# Altium schematic sheet PiCarHat_Master_V4.SchDoc
size A2; SheetNumber: 1; SheetTotal: 1; SPICEModelCacheWKMVAURK: <root> / <DocumentId>WKMVAURK</DocumentId> / </root>
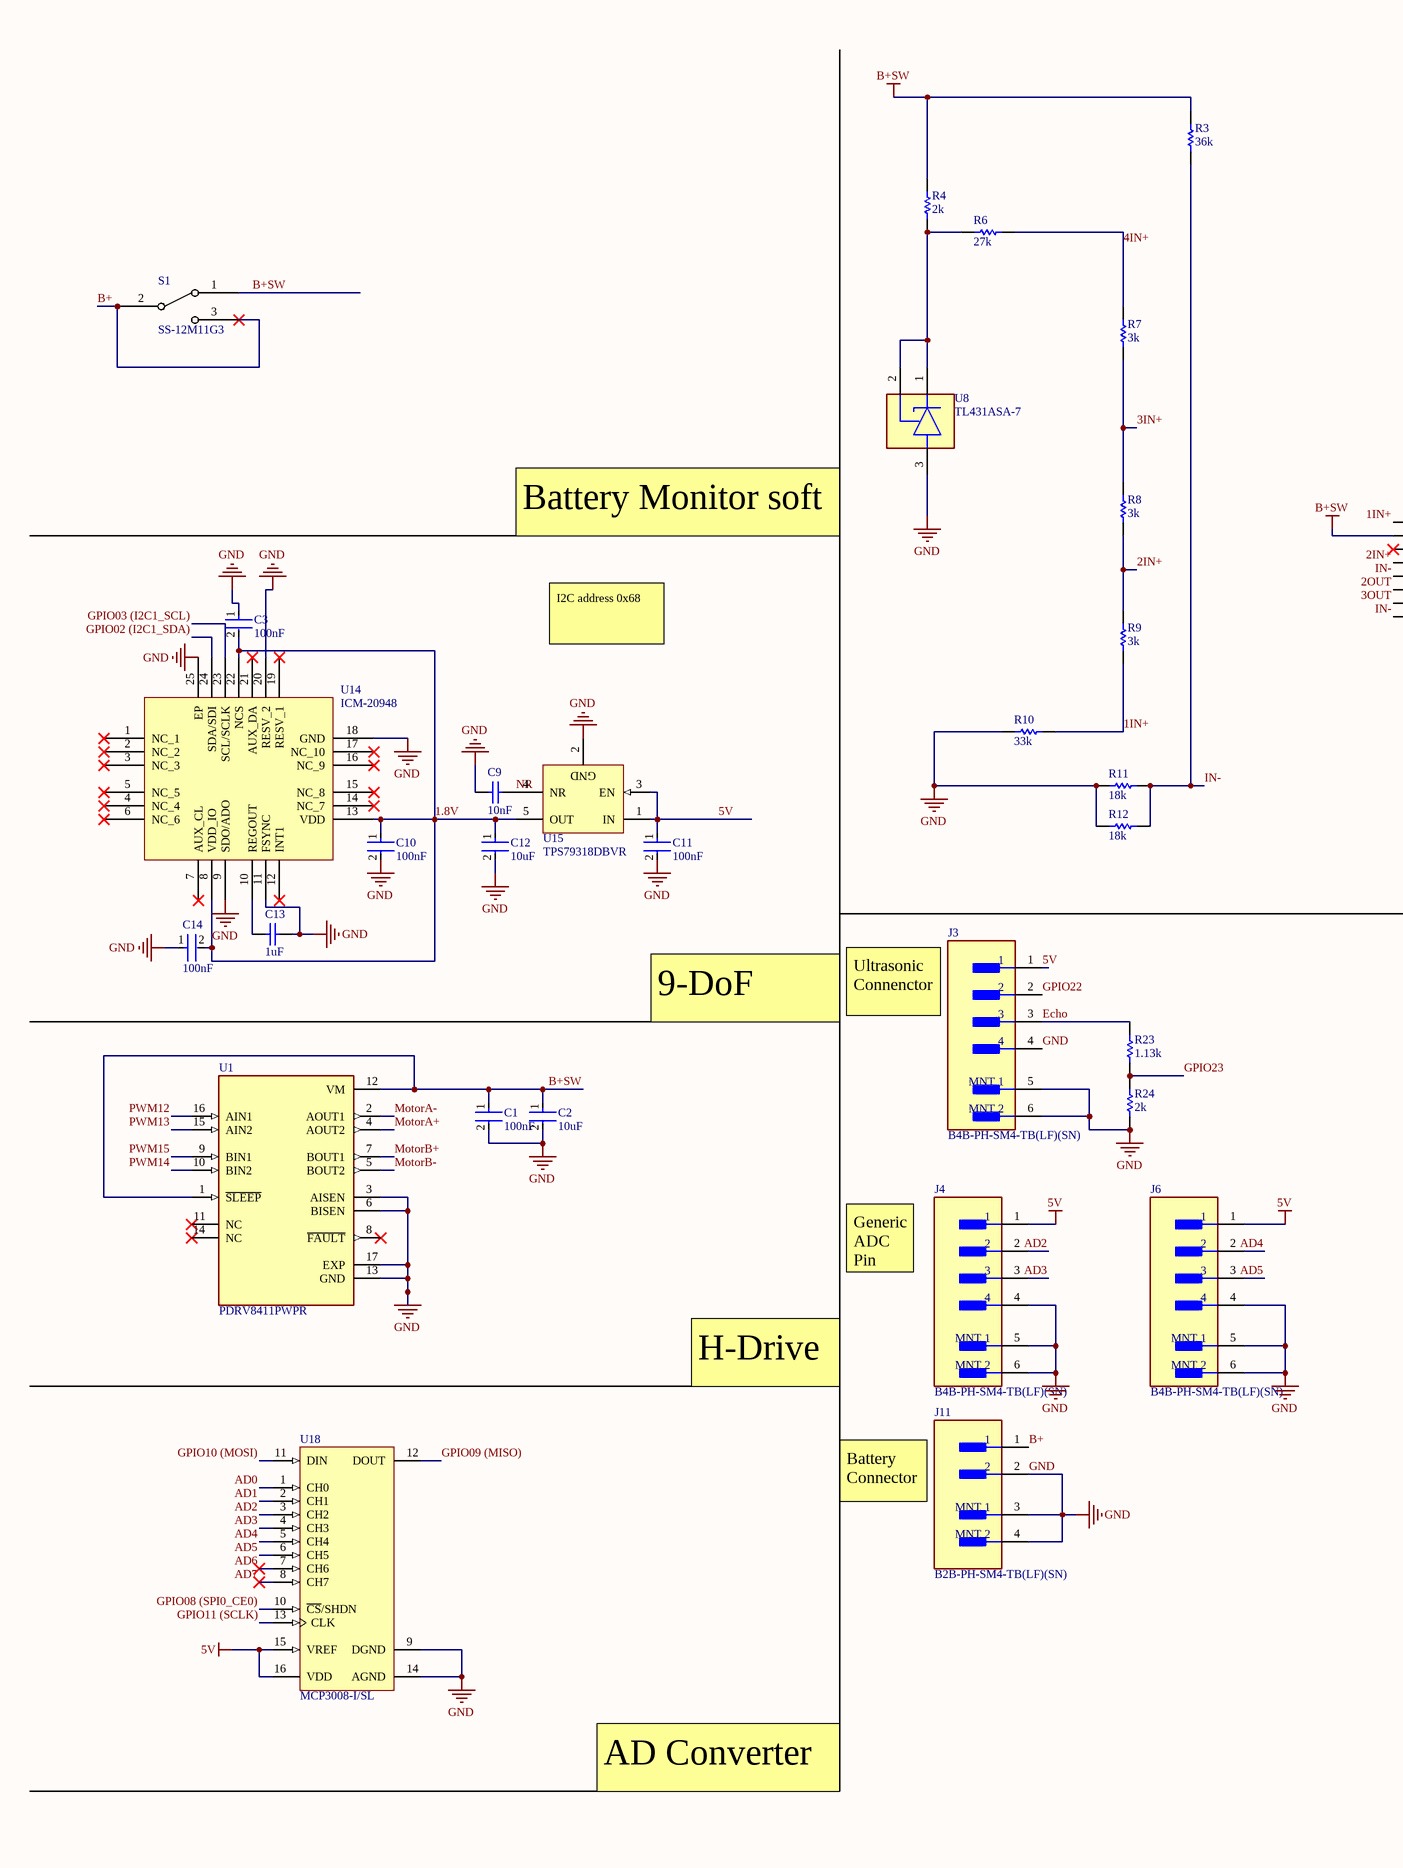
[diagram p0: PiCarHat_Master_V4.SchDoc, left]
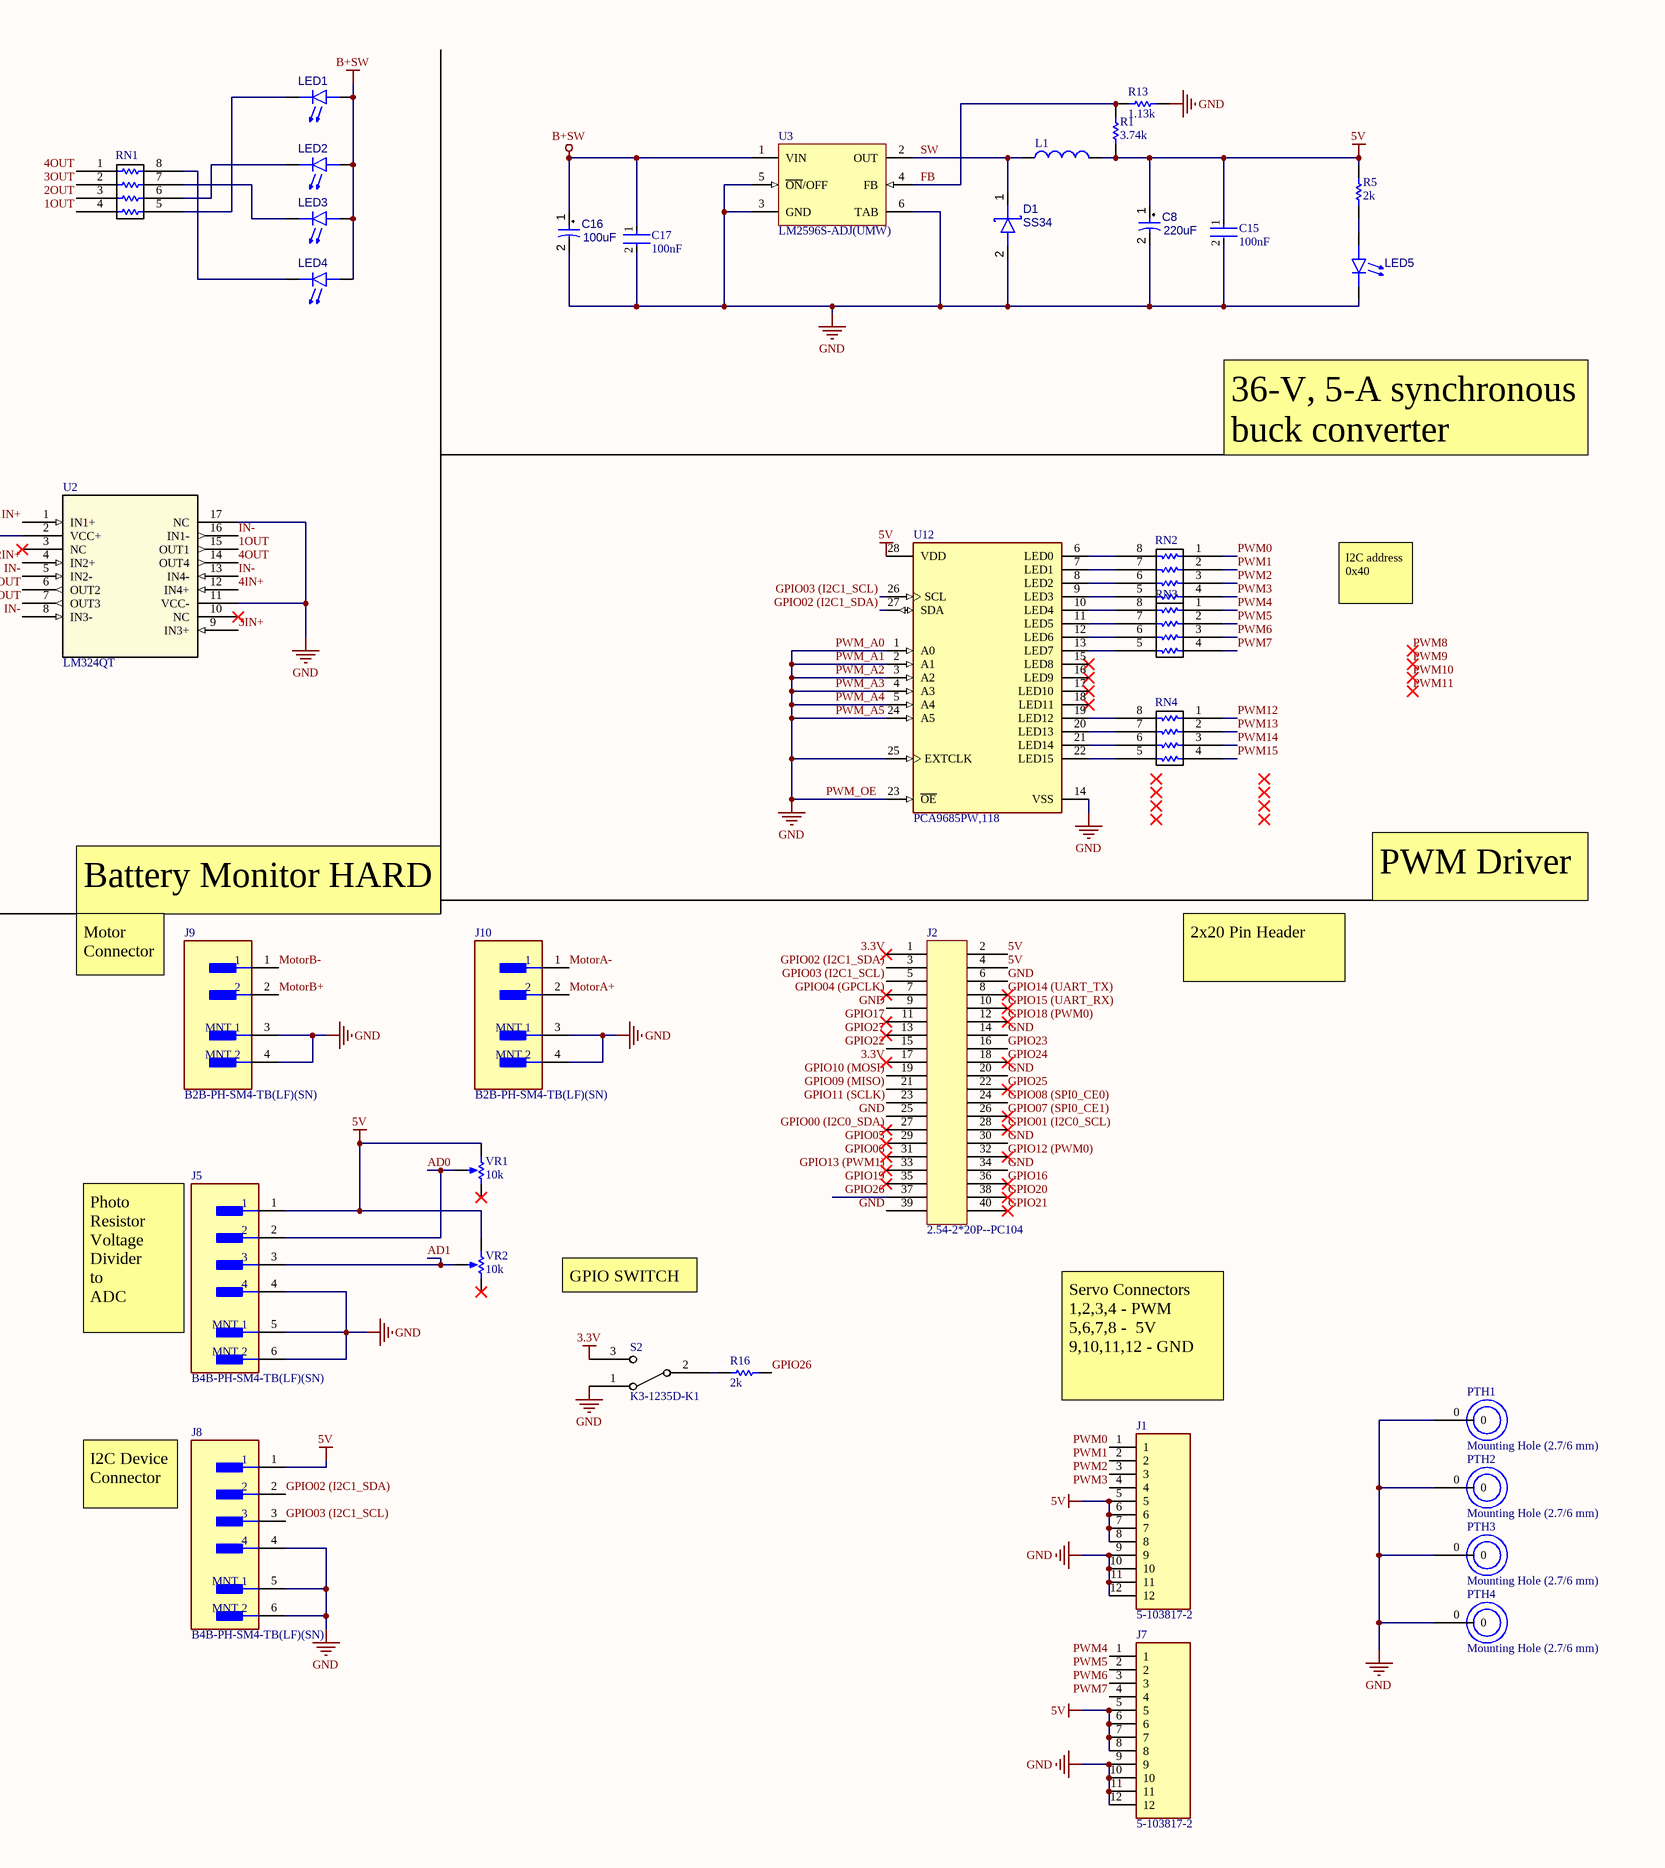
[diagram p1: PiCarHat_Master_V4.SchDoc, right]

## Parts
C1  100nF  [FP-CC0805-0_85-IPC_B]
C2  10uF  [FP-GRM21B-0_15-MFG]
C3  100nF  [FP-CC0805-0_85-IPC_B]
C8  220uF  [RVT1A221M0605-Footprint-1]
C9  10nF  [CAPC2013X100X50NL20T25]
C10  100nF  [FP-CC0805-0_85-IPC_B]
C11  100nF  [FP-CC0805-0_85-IPC_B]
C12  10uF  [FP-GRM21B-0_15-MFG]
C13  1uF  [CAPC2013X140X50LL20T25]
C14  100nF  [FP-CC0805-0_85-IPC_B]
C15  100nF  [FP-CC0805-0_85-IPC_B]
C16  100uF  [RVT1C101M0605-Footprint-1]
C17  100nF  [FP-CC0805-0_85-IPC_B]
D1  SS34  [SS34-Footprint-1]
J1  5-103817-2  [TE_5-103817-2]
J2  2.54-2*20P--PC104  [New footprint 1]
J3  B4B-PH-SM4-TB(LF)(SN)  [FP-B4B-PH-SM4-TB-MFG]
J4  B4B-PH-SM4-TB(LF)(SN)  [FP-B4B-PH-SM4-TB-MFG]
J5  B4B-PH-SM4-TB(LF)(SN)  [FP-B4B-PH-SM4-TB-MFG]
J6  B4B-PH-SM4-TB(LF)(SN)  [FP-B4B-PH-SM4-TB-MFG]
J7  5-103817-2  [TE_5-103817-2]
J8  B4B-PH-SM4-TB(LF)(SN)  [FP-B4B-PH-SM4-TB-MFG]
J9  B2B-PH-SM4-TB(LF)(SN)  [FP-B2B-PH-SM4-TB_LF_SN-MFG]
J10  B2B-PH-SM4-TB(LF)(SN)  [FP-B2B-PH-SM4-TB_LF_SN-MFG]
J11  B2B-PH-SM4-TB(LF)(SN)  [FP-B2B-PH-SM4-TB_LF_SN-MFG]
L1  FXL1050-470-M  [FXL1050-470-M-Footprint-1]  (value not drawn)
LED1  KT-0603R  [XL-1608SURC-06-Footprint-1]  (value not drawn)
LED2  KT-0603R  [XL-1608SURC-06-Footprint-1]  (value not drawn)
LED3  KT-0603R  [XL-1608SURC-06-Footprint-1]  (value not drawn)
LED4  KT-0603R  [XL-1608SURC-06-Footprint-1]  (value not drawn)
LED5  KT-0603R  [XL-1608SURC-06-Footprint-1]  (value not drawn)
PTH1  Mounting Hole (2.7/6 mm)  [New footprint 1]
PTH2  Mounting Hole (2.7/6 mm)  [New footprint 1]
PTH3  Mounting Hole (2.7/6 mm)  [New footprint 1]
PTH4  Mounting Hole (2.7/6 mm)  [New footprint 1]
R1  3.74k  [RESC1608X55X30LL15T15]
R3  36k  [RESC1608X55X30LL20T20]
R4  2k  [RESC1608X55X25LL10T15]
R5  2k  [RESC1608X55X25LL10T15]
R6  27k  [RESC1608X55X25LL10T15]
R7  3k  [RESC1608X55X25LL10T15]
R8  3k  [RESC1608X55X25LL10T15]
R9  3k  [RESC1608X55X25LL10T15]
R10  33k  [RESC1608X55X25LL10T15]
R11  18k  [RESC1608X55X30LL15T15]
R12  18k  [RESC1608X55X30LL15T15]
R13  1.13k  [RESC1609X50X30LL10T20]
R16  2k  [RESC1608X55X25LL10T15]
R23  1.13k  [RESC1609X50X30LL10T20]
R24  2k  [RESC1608X55X25LL10T15]
RN1  4D03WGJ0103T5E  [4D03WGJ0103T5E-Footprint-1]  (value not drawn)
RN2  4D03WGJ0101T5E  [4D03WGJ0101T5E-Footprint-1]  (value not drawn)
RN3  4D03WGJ0101T5E  [4D03WGJ0101T5E-Footprint-1]  (value not drawn)
RN4  4D03WGJ0101T5E  [4D03WGJ0101T5E-Footprint-1]  (value not drawn)
S1  SS-12M11G3  [SS-12M11G5-Footprint-1]
S2  K3-1235D-K1  [K3-1235D-K1-Footprint-1]
U1  PDRV8411PWPR  [PWP0016C-IPC_B]
U2  LM324QT  [LM324QT-Footprint-1]
U3  LM2596S-ADJ(UMW)  [TS5B_L]
U8  TL431ASA-7  [FP-SOT23-MFG]
U12  PCA9685PW,118  [FP-SOT361-1-IPC_B]
U14  ICM-20948  [TDK-QFN-24_L]
U15  TPS79318DBVR  [DBV0005A_M]
U18  MCP3008-I/SL  [SOIC-SL16_L]
VR1  value 10k  [BOUR-3362P]  (hidden comment: 3362P-1-103LF)
VR2  value 10k  [BOUR-3362P]  (hidden comment: 3362P-1-103LF)

## Nets
3.3V: J2.1 J2.17 S2.3
5V: C8.1 C11.1 C15.1 J1.5 J1.6 J1.7 J1.8 J2.2 J2.4 J3.1 J4.1 J5.1 J6.1 J7.5 J7.6 J7.7 J7.8 J8.1 L1.2 R1.1 R5.2 U12.28(VDD) U15.1(IN) U15.3(EN) U18.15(VREF) U18.16(VDD) VR1.1(CCW) VR2.1(CCW)
B+SW: C1.1 C2.1 C16.1 C17.1 LED1.2(A) LED2.2(A) LED3.2(A) LED4.2(A) R3.2 R4.2 S1.1 U1.1(~{SLEEP}) U1.12(VM) U2.2(VCC+) U3.1(VIN)
GND: C1.2 C2.2 C3.1 C8.2 C9.1 C10.2 C11.2 C12.2 C13.2 C14.1 C15.2 C16.2 C17.2 D1.2(A) J1.9 J1.10 J1.11 J1.12 J2.6 J2.9 J2.14 J2.20 J2.25 J2.30 J2.34 J2.39 J3.4 J3.5(MNT_1) J3.6(MNT_2) J4.4 J4.5(MNT_1) J4.6(MNT_2) J5.4 J5.5(MNT_1) J5.6(MNT_2) J6.4 J6.5(MNT_1) J6.6(MNT_2) J7.9 J7.10 J7.11 J7.12 J8.4 J8.5(MNT_1) J8.6(MNT_2) J9.3(MNT_1) J9.4(MNT_2) J10.3(MNT_1) J10.4(MNT_2) J11.2 J11.3(MNT_1) J11.4(MNT_2) LED5.1(K) PTH1.0 PTH2.0 PTH3.0 PTH4.0 R10.1 R11.1 R12.1 R13.2 R24.1 S2.1 U1.3(AISEN) U1.6(BISEN) U1.13(GND) U1.17(EXP) U2.11(VCC-) U2.17(NC) U3.3(GND) U3.5(~{ON}/OFF) U3.6(TAB) U8.3(A) U12.1(A0) U12.2(A1) U12.3(A2) U12.4(A3) U12.5(A4) U12.14(VSS) U12.23(~{OE}) U12.24(A5) U12.25(EXTCLK) U14.9(SDO/ADO) U14.11(FSYNC) U14.18(GND) U14.20(RESV_2) U14.25(EP) U15.2(GND) U18.9(DGND) U18.14(AGND)  [also labelled PWM_A0, PWM_A1, PWM_A2, PWM_A3, PWM_A4, PWM_A5, PWM_OE]
1.8V: C3.2 C10.1 C12.1 C14.2 U14.8(VDD_IO) U14.13(VDD) U14.22(NCS) U15.5(OUT)
1IN+: R9.2 R10.2 U2.1(IN1+)
1OUT: RN1.4 U2.15(OUT1)
2IN+: R8.2 R9.1 U2.4(IN2+)
2OUT: RN1.3 U2.6(OUT2)
3IN+: R7.2 R8.1 U2.9(IN3+)
3OUT: RN1.2 U2.7(OUT3)
4IN+: R6.2 R7.1 U2.12(IN4+)
4OUT: RN1.1 U2.14(OUT4)
AD0: J5.2 U18.1(CH0) VR1.2(S)
AD1: J5.3 U18.2(CH1) VR2.2(S)
AD2: J4.2 U18.3(CH2)
AD3: J4.3 U18.4(CH3)
AD4: J6.2 U18.5(CH4)
AD5: J6.3 U18.6(CH5)
AD6: U18.7(CH6)
AD7: U18.8(CH7)
B+: J11.1 S1.2 S1.3
Echo: J3.3 R23.2
FB: R1.2 R13.1 U3.4(FB)
GPIO00 (I2C0_SDA): J2.27
GPIO01 (I2C0_SCL): J2.28
GPIO02 (I2C1_SDA): J2.3 J8.2 U12.27(SDA) U14.24(SDA/SDI)
GPIO03 (I2C1_SCL): J2.5 J8.3 U12.26(SCL) U14.23(SCL/SCLK)
GPIO04 (GPCLK): J2.7
GPIO05: J2.29
GPIO06: J2.31
GPIO07 (SPI0_CE1): J2.26
GPIO08 (SPI0_CE0): J2.24 U18.10(~{CS}/SHDN)
GPIO09 (MISO): J2.21 U18.12(DOUT)
GPIO10 (MOSI): J2.19 U18.11(DIN)
GPIO11 (SCLK): J2.23 U18.13(CLK)
GPIO12 (PWM0): J2.32
GPIO13 (PWM1): J2.33
GPIO14 (UART_TX): J2.8
GPIO15 (UART_RX): J2.10
GPIO16: J2.36
GPIO17: J2.11
GPIO18 (PWM0): J2.12
GPIO19: J2.35
GPIO20: J2.38
GPIO21: J2.40
GPIO22: J2.15 J3.2
GPIO23: J2.16 R23.1 R24.2
GPIO24: J2.18
GPIO25: J2.22
GPIO26: J2.37 R16.1
GPIO27: J2.13
IN-: R3.1 R11.2 R12.2 U2.5(IN2-) U2.8(IN3-) U2.13(IN4-) U2.16(IN1-)
MotorA+: J10.2 U1.4(AOUT2)
MotorA-: J10.1 U1.2(AOUT1)
MotorB+: J9.2 U1.7(BOUT1)
MotorB-: J9.1 U1.5(BOUT2)
NR: C9.2 U15.4(NR)
PWM0: J1.1 RN2.1
PWM1: J1.2 RN2.2
PWM2: J1.3 RN2.3
PWM3: J1.4 RN2.4
PWM4: J7.1 RN3.1
PWM5: J7.2 RN3.2
PWM6: J7.3 RN3.3
PWM7: J7.4 RN3.4
PWM12: RN4.1 U1.16(AIN1)
PWM13: RN4.2 U1.15(AIN2)
PWM14: RN4.3 U1.10(BIN2)
PWM15: RN4.4 U1.9(BIN1)
SW: D1.1(K) L1.1 U3.2(OUT)
NetC13_1: C13.1 U14.10(REGOUT)
NetLED1_1: LED1.1(K) RN1.5
NetLED2_1: LED2.1(K) RN1.6
NetLED3_1: LED3.1(K) RN1.7
NetLED4_1: LED4.1(K) RN1.8
NetLED5_2: LED5.2(A) R5.1
NetR4_1: R4.1 R6.1 U8.1(C) U8.2(REF)
NetR16_2: R16.2 S2.2
NetRN2_5: RN2.5 U12.9(LED3)
NetRN2_6: RN2.6 U12.8(LED2)
NetRN2_7: RN2.7 U12.7(LED1)
NetRN2_8: RN2.8 U12.6(LED0)
NetRN3_5: RN3.5 U12.13(LED7)
NetRN3_6: RN3.6 U12.12(LED6)
NetRN3_7: RN3.7 U12.11(LED5)
NetRN3_8: RN3.8 U12.10(LED4)
NetRN4_5: RN4.5 U12.22(LED15)
NetRN4_6: RN4.6 U12.21(LED14)
NetRN4_7: RN4.7 U12.20(LED13)
NetRN4_8: RN4.8 U12.19(LED12)

Not connected (* = marked no-connect by the designer): U1 8(~{FAULT})* 11(NC)* 14(NC)*; U2 3(NC)* 10(NC)*; U12 15(LED8)* 16(LED9)* 17(LED10)* 18(LED11)*; U14 1(NC_1)* 2(NC_2)* 3(NC_3)* 4(NC_4)* 5(NC_5)* 6(NC_6)* 7(AUX_CL)* 12(INT1)* 14(NC_7)* 15(NC_8)* 16(NC_9)* 17(NC_10)* 19(RESV_1)* 21(AUX_DA)*; VR1 3(CW)*; VR2 3(CW)*

## Notes on the sheet
- 36-V, 5-A synchronous buck converter 12-WSON -40 to 150
- Battery Monitor soft
- I2C address 0x40
- I2C address 0x68
- Battery Monitor HARD
- PWM Driver
- Motor
  Connector
- 2x20 Pin Header
- 9-DoF IMU
- Ultrasonic
  Connenctor
- Generic
  ADC
  Pin
- Photo
  Resistor
  Voltage
  Divider
  to
  ADC
- GPIO SWITCH
- H-Drive
- (near J1) Servo Connectors
  1,2,3,4 - PWM
  5,6,7,8 -  5V
  9,10,11,12 - GND
- Battery
  Connector
- I2C Device
  Connector
- AD Converter
- Labels drawn without touching a wire or pin: PWM8, PWM9, PWM10, PWM11

## Library data of the parts
C1 C3 C10 C11 C14 C15 C17 = CMP-2100-03606-3: 50V 100nF X7R ±10% 0805 Multilayer Ceramic Capacitors MLCC - SMD/SMT ROHS; Part Number: CC0805KRX7R9BB104; Manufacturer: Yageo; Tolerance: 0.1; Device Class L1: Passive Components; ComponentLink2Description: Datasheet; Package: CC0805-0.85; Digikey Description: CAP CER 0.1UF 50V X7R 0805; Capacitance: 100 nF; Device Class L3: Ceramic Capacitors; Value: 100 nF; Temperature: -30°C to +85°C; Temperature Characteristic: X7R; Voltage Rating: 50 V; Height: 0.95mm; RoHS: TRUE; Ipc Land Pattern Name: CAPC200125X85; Device Class L2: Capacitors; Category: Cap; Temperature Range Low: -30°C; Temperature Range High: +85°C; Material: Ceramic; Mouser Description: Multilayer Ceramic Capacitors MLCC - SMD/SMT 100nF 50V X7R 10%; Footprint Url: http://www.yageo.com/exep/pages/download/literatures/UPY-C_GEN_24.pdf; Automotive: No; Octopart: https://octopart.com/cc0805krx7r9bb104-yageo-192993; Lead Free: Yes; ComponentLink2URL: http://www.yageo.com/documents/recent/UPY-GPHC_Y5V_6.3V-to-50V_8.pdf; JLCPCB Part #: C1711
C2 C12 = CMP-2007-03541-2: 25V 10uF X5R ±10% 0805 Multilayer Ceramic Capacitors MLCC - SMD/SMT ROHS; Part Number: GRM21BR61E106KA73L; Length: 2mm; Depth: 1.25mm; Termination: SMD/SMT; Voltage: 25V; Height: 1.25mm; Material: Ceramic; Thickness: 0.053inch; Radiation Hardening: No; Min Operating Temperature: -55°C; Width: 0.049inch; Package Quantity: 1; Mount: Surface Mount; Dielectric: X5R; Packaging: Tape and Reel; Capacitance: 10uF; Voltage Rating (DC): 25V; Lead Free: Lead Free; Max Operating Temperature: 85°C; Case Code (Imperial): 0805; Case/Package: 0805; Tolerance: 10%; Voltage Rating: 25V; Case Code (Metric): 2012; JLCPCB Part #: C15850
C8 = CMP-001-00090-1: 220uF 10V 90mA@120Hz ±20% SMD, D6.3xL5.4mm Aluminum Electrolytic Capacitors - SMD ROHS; Part Number: RVT1A221M0605; JLCPCB Part #: C3345
C9 = CMP-2007-03708-1: 50V 10nF X7R ±10% 0805 Multilayer Ceramic Capacitors MLCC - SMD/SMT ROHS; Part Number: C0805F103K5RACTU; Manufacturer: Kemet; JLCPCB Part #: C1710
C13 = CMP-2007-03234-1: 50V 1uF X7R ±10% 0805 Multilayer Ceramic Capacitors MLCC - SMD/SMT ROHS; Part Number: C0805C105K3RACTU; Manufacturer: Kemet; JLCPCB Part #: C28323
C16 = CMP-001-00087-2: 100uF 16V 63mA@120Hz ±20% SMD, D6.3xL5.4mm Aluminum Electrolytic Capacitors - SMD ROHS; Part Number: RVT1C101M0605; Capacitor Type: Electrolytic; JLCPCB Part #: C37308
D1 = CMP-004-00033-3: 40V Independent Type 3A 550mV@3A SMA(DO-214AC) Schottky Diodes ROHS; JLCPCB Part #: C8678; Part Number: SS34
J1 J7 = CMP-023-000000-3: 2.54mm Pin Headers ROHS=Gold 1kV 3A Direct Insert Policy 2.5mm 260℃ 3mm 12P -40℃~+105℃ 6mm 2.54mm Triple row Brass 3x4P Plugin,P=2.54mm Pin Headers ROHS=2.54mm Pin Headers ROHS; Part Number: TSW-104-07-L-T; Centerline_Pitch: 2.54 mm[.1 in]; Number_of_Positions: 12; MF: TE Connectivity; Product_Type: Connector; DigiKey-Purchase-URL: https://snapeda.com/shop?store=DigiKey&id=1068516; Source: 5-103817-2.SchLib; Arrow_Electronics-Purchase-URL: https://snapeda.com/shop?store=Arrow+Electronics&id=1068516; EU_RoHS_Compliance: Compliant; Price: None; Availability: Unavailable; MP: 5-103817-2; Pin Count: 12; Package: None; SnapEDA_Link: https://www.snapeda.com/parts/5-103817-2/TE%20Connectivity%20AMP%20Connectors/view-part/1068516/?ref=snap; Design Item ID: 5-103817-2; Component Type: Standard; Mouser-Purchase-URL: https://snapeda.com/shop?store=Mouser&id=1068516; JLCPCB Part #: C32713291
  J1: Value: *
J2 = CMP-002-00076-7: 2.54mm 2.54mm Double Row 40P Brass Direct Insert 2x20P Plugin,P=2.54mm Female Headers ROHS; Part Number: 2.54-2*20P母长PC104; JLCPCB Part #: C35165
J3-J6 J8 = CMP-002-00074-1: 2.0mm pitch/Disconnectable Insulation displacement and Crimp style connectors; Part Number: B4B-PH-SM4-TB(LF)(SN); JLCPCB Part #: C160354
J9-J11 = CMP-002-00073-1: 1x2P 2P PH Tin 2 -25℃~+85℃ 2A 1 2mm Brass Alloy Standing paste SMD,P=2mm Wire To Board Connector ROHS; Part Number: B2B-PH-SM4-TB; JLCPCB Part #: C160352
L1 = CMP-006-00021-2: 3.7A 47uH Integrated molded inductor ±20% 4.5A SMD,10x11.5mm Power Inductors ROHS; Part Number: FXL1050-470-M; JLCPCB Part #: C5359268
LED1-LED5 = CMP-007-00038-5: -40℃~+85℃ Red 0603 LED Indication - Discrete ROHS; Part Number: KT-0603R; JLCPCB Part #: C2286
PTH1-PTH4 = CMP-00030-00001-4: DO NOT PLACE; P&P Comment: NO NOT PLACE; Part Number: *
R1 = CMP-2000-00466-1: 100mW Thick Film Resistors 75V ±100ppm/℃ ±1% 3.74kΩ 0603 Chip Resistor - Surface Mount ROHS; Part Number: ERJ-3EKF3741V; Manufacturer: Panasonic; JLCPCB Part #: C137728
R3 = CMP-2000-00046-1: 100mW Thick Film Resistors 75V ±100ppm/℃ ±1% 36kΩ 0603 Chip Resistor - Surface Mount ROHS; Manufacturer: Panasonic; Part Number: ERA3AEB363V; JLCPCB Part #: C23147
R4 R5 R16 R24 = CMP-2000-06937-1: 100mW Thick Film Resistors 75V ±100ppm/℃ ±1% 2kΩ 0603 Chip Resistor - Surface Mount ROHS; Manufacturer: Yageo; Part Number: RC0603FR-072KL; PCN Other: RC/AC0603/0805/120622/Jan/2013; Catalog Drawings: ThickFilmResistorTopThickFilmResistorSide; Kits: PHH4-KIT-ND-RESKIT1K-9.76K1/10W5700PCS; EDA / CAD Models: DownloadfromAcceleratedDesigns; HTML Datasheet: RCSeries,LSuffixDatasheet.html; Power (Watts): 0.1W,1/10W; Other Names: 311-2.00KHRCT; Temperature Coefficient: ±100ppm/°C; Online Catalog: RC0603Series; Features: MoistureResistant; Height: 0.022"(0.55mm); Size / Dimension: 0.063"Lx0.031"W(1.60mmx0.80mm); Resistance (Ohms): 2k; Product Training Modules: ChipResistor; Mounting Technology: SurfaceMount; Package / Case: 0603(1608Metric); Supplier Device Package: 0603; Category: Resistors; Tolerance: ±1%; Packaging: CutTape(CT); Operating Temperature: -55°C~155°C; Standard Package: 1; Series: RC; Datasheet URL: http://www.yageo.com/documents/recent/PYu-RC_Group_51_RoHS_L_7.pdf; Package Description: 2-Pin Surface Mount Device, Body 1.6 x 0.8 mm; Number of Terminations: 2; Datasheet Version: Rev. 7, 05/2017; Package Reference: 0603; Composition: ThickFilm; Manufacturer URL: http://www.yageo.com/; Family: ChipResistor-SurfaceMount; JLCPCB Part #: C22975
R6 = CMP-2000-06933-1: 100mW Thick Film Resistors 75V ±100ppm/℃ ±1% 27kΩ 0603 Chip Resistor - Surface Mount ROHS; Manufacturer: Yageo; Part Number: RC0603FR-0727KL; Resistance: 27kOhms; Temperature Coefficient: 100PPM/C; Voltage Rating: 50V; Mounting Technology: SurfaceMount; Operating Temperature Range: -55Cto+155C; Case Code - in: 0603; Product: ThickFilmResistorsGeneralPurpose; Package Reference: 0603; Datasheet Version: Rev. 7, 05/2017; Tolerance: 1%; Manufacturer URL: http://www.yageo.com/; Termination Style: SMD/SMT; Packaging: Reel; Series: RC; Power Rating: 100mW; Package Description: 2-Pin Surface Mount Device, Body 1.6 x 0.8 mm; Datasheet URL: http://www.yageo.com/documents/recent/PYu-RC_Group_51_RoHS_L_7.pdf; Case Code - mm: 1608; JLCPCB Part #: C22967
R7-R9 = CMP-2000-04040-1: 100mW Thick Film Resistors 75V ±100ppm/℃ ±1% 3kΩ 0603 Chip Resistor - Surface Mount ROHS; Manufacturer: Yageo; Part Number: RC0603FR-073KL; JLCPCB Part #: C4211
R10 = CMP-2000-06938-1: 100mW Thick Film Resistors 75V ±100ppm/℃ ±1% 33kΩ 0603 Chip Resistor - Surface Mount ROHS; Manufacturer: Yageo; Part Number: RC0603FR-0733KL; Voltage Rating: 50V; Resistance: 33kOhms; Temperature Coefficient: 100PPM/C; Datasheet Version: Rev. 7, 05/2017; Case Code - in: 0603; Product: ThickFilmResistorsGeneralPurpose; Tolerance: 1%; Case Code - mm: 1608; Manufacturer URL: http://www.yageo.com/; Power Rating: 100mW; Datasheet URL: http://www.yageo.com/documents/recent/PYu-RC_Group_51_RoHS_L_7.pdf; Termination Style: SMD/SMT; Package Description: 2-Pin Surface Mount Device, Body 1.6 x 0.8 mm; Series: RC; Packaging: Reel; Mounting Technology: SurfaceMount; Operating Temperature Range: -55Cto+155C; Package Reference: 0603; JLCPCB Part #: C4216
R11 R12 = CMP-1012-00650-3: 100mW Thick Film Resistors 75V ±100ppm/℃ ±1% 18kΩ 0603 Chip Resistor - Surface Mount ROHS; Manufacturer: Panasonic; Part Number: ERJ3EKF1802V; JLCPCB Part #: C25810
R13 R23 = CMP-2000-02979-1: 100mW Thick Film Resistors 75V ±100ppm/℃ ±1% 1.13kΩ 0603 Chip Resistor - Surface Mount ROHS; Part Number: CRCW06031K13FKEA; Manufacturer: Vishay Dale; JLCPCB Part #: C137782
RN1 = CMP-009-00177-2: 4 ±5% 10kΩ 62.5mW ±200ppm/℃ 0603x4 Resistor Networks, Arrays ROHS; RoHS Compliant: Yes; Part Number: 4D03WGJ0103T5E; JLCPCB Part #: C29718
RN2-RN4 = CMP-009-00185-2: 4 ±5% 100Ω 62.5mW ±200ppm/℃ 0603x4 Resistor Networks, Arrays ROHS; RoHS Compliant: Yes; Part Number: 4D03WGJ0101T5E; JLCPCB Part #: C25506
S1 = CMP-011-00018-2: Horizontal Plug 6A Single Pole Double Throw (SPDT) 120V 120V 6A 10000 times Black Plugin Slide Switches ROHS; JLCPCB Part #: C2879832; Part Number: SS-12M11G3
S2 = CMP-011-00015-2: 300mA Direct Insert Single Pole Double Throw (SPDT) 6V 10,000 times Black Plugin Slide Switches ROHS; Part Number: K3-1235D-K1; JLCPCB Part #: C145860
U1 = CMP-00024-00008-1: 1.65-V to 11-V, 4-A, dual H-bridge motor driver with current regulation 16-HTSSOP -40 to 125; JLCPCB Part #: C18212622; Part Number: PDRV8411PWPR
U2 = CMP-014-00002-6: Operational Amplifier, 4 Func, 9000uV Offset-Max, BIPolar, PQCC16; Channels: 4; Nominal Supply Voltage: 5V; RoHS Compliant: Yes; Min Operating Temperature: 0°C; Max Operating Temperature: 70°C; Pins: 16; Case/Package: HVQCCN; Part Number: LM324QT; JLCPCB Part #: C183029
U3 = CMP-0069-00272-2: Step-down type Adjustable 40V 1.2V~37V 3A TO-263-5 DC-DC Converters ROHS; Manufacturer: National Semiconductor; PackageTopMarking: NSUZXYTTE#*LM2596S*-ADJ P+; CompType: Switcher; PowerWise: N; ComponentLink1Description: LM2596 Datasheet; RoHS: N; PackageVersion: revD, Apr-2005; DatasheetVersion: May-2002; ComponentLink2Description: LM2596 Web Page; ComponentLink2URL: http://www.national.com/pf/LM/LM2596.html; RevisionNote: Component URLs added; PackageDescription: TO-263, Molded, .400 x .390 x .180in, 5 Lead, .067in Pitch, Surface Mount; ComponentLink3Description: TS5B Package Page; ComponentLink1URL: http://www.national.com/ds/LM/LM2596.pdf; PackageReference: TS5B; Code_JEDEC: MO-169-AB; PinCount: 5; ComponentLink3URL: http://www.national.com/packaging/folders/ts5b.html; Part Number: LM2596S-ADJ(UMW); JLCPCB Part #: C347423
U8 = CMP-12755-000001-1: 2.495V~36V ±1% 100mA Adjustable SOT-23 Voltage Reference ROHS; Manufacturer: DIODES INC.; Standoff Height: 0.013mm; Reference Type: Shunt; Max Power Dissipation: 330mW; Max Junction Temp: +150°C; Output Type: AdjustableProgrammable; Octopart: https://octopart.com/tl431asa-7-diodes+inc.-18832779; Automotive: No; Digikey Description: IC VREF SHUNT ADJ SOT23-3; Temperature: to +150°C; Ambient Temperature Range High: +125°C; Ipc Land Pattern Name: SOT92P240X102-3; ComponentLink2URL: https://www.diodes.com/assets/Datasheets/TL431_432.pdf; RoHS: TRUE; Manufacturer Part Number: TL431ASA-7; Mouser Description: V-Ref Adjustable 2.495V to 36V 100mA 3-Pin SOT-23 T/R; Package: SOT23; Ambient Temperature Range Low: -40°C; Device Class L3: Voltage References; Temperature Range High: +150°C; ComponentLink2Description: Datasheet; Footprint Url: https://www.diodes.com/assets/Package-Files/SOT23.pdf; Category: IC; Device Class L2: Power Management ICs; Device Class L1: Integrated Circuits (ICs); Lead Free: Yes; Height: 1.1mm; Part Number: TL431ASA-7; JLCPCB Part #: C145101
U12 = CMP-1595-00003-3: IC LED DRIVER RGBA 28-TSSOP; Manufacturer: NXP Semiconductors; Max Power Dissipation: 400mW; Dimming: I2C,PWM; Number Of Outputs: 16; Import Ts: 1521846855; Min Supply Voltage: 2.3V; Max Supply Voltage: 5.5V; Output Voltage: 5V; Nominal Supply Current: 6mA; Standoff Height: 0.05mm; Output Current: 25mA; Ciiva Ids: 1426473; Temperature Range Low: -40°C; Footprint Url: https://www.nxp.com/docs/en/package-information/SOT361-1.pdf; Height: 1.1mm; Manufacturer Part Number: PCA9685PW,118; Device Class L2: Power Management ICs; Temperature: -40°C to +85°C; Temperature Range High: +85°C; Digikey Description: IC LED DRIVER RGBA 28-TSSOP; ComponentLink2Description: Datasheet; Device Class L3: LED Drivers; Ambient Temperature Range Low: -40°C; ComponentLink2URL: https://www.nxp.com/docs/en/data-sheet/PCA9685.pdf; Ambient Temperature Range High: +85°C; Device Class L1: Integrated Circuits (ICs); Mouser Description: LED Display Drivers I2C Bus LED Controller 28-Pin; Octopart: https://octopart.com/pca9685pw%2C118-nxp+semiconductors-11853435; Release Date: 1454319143; Lead Free: Yes; Category: IC; RoHS: TRUE; Package: SOT361-1; Automotive: No; Part Number: PCA9685PW,118; JLCPCB Part #: C2678753
U14 = CMP-031-00007-7: Accelerometer and Gyroscope Compass 9-Axis Digital 24-Pin QFN T/R; Max Supply Voltage: 3.6V; Min Supply Voltage: 1.71V; Mounting Technology: Surface Mount; Max Operating Temperature: 85°C; Case/Package: QFN; Min Operating Temperature: -40°C; Part Number: ICM-20948; JLCPCB Part #: C726001
U15 = CMP-0394-00328-2: 200mA 70dB Fixed 1.8V Positive electrode 5.5V SOT-23-5 Voltage Regulators - Linear, Low Drop Out (LDO) Regulators ROHS; Manufacturer: Texas Instruments; Vdo(Typ)(mV): 112; SubFamily: Single Channel LDO; Eco-Plan: Green (RoHS & no Sb/Br); Iq(Typ)(mA): 0.2; Vin(Max)(V): 5.5; Accuracy(%): 2; Rating: Catalog; Vin(Min)(V): 2.7; Vout Adj(Max)(V): 1.8; ComponentLink3URL: http://www.ti.com/litv/pdf/mpds018i; PackageVersion: 4073253-4/K; ComponentLink3Description: Package Specification; PackageDescription: 5-Pin Plastic Small Outline, Body 1.60 Ãƒâ€” 2.90 mm, Pitch 0.95 mm; Mounting Technology: Surface Mount; DatasheetVersion: SLVS348K; Part Number: TPS79318DBVR; ComponentLink1Description: Manufacturer URL; ComponentLink2Description: Datasheet; PackageReference: DBV0005A; Iout(Max)(A): 0.2; Fixed Output Options(V): 1.8; Vout Adj(Min)(V): 1.8; Code_JEDEC: MO-178; ComponentLink1URL: http://www.ti.com/; ComponentLink2URL: http://www.ti.com/general/docs/lit/getliterature.tsp?genericPartNumber=TPS79318&fileType=pdf; JLCPCB Part #: C7102
U18 = CMP-0188-00041-2: 2.7V 4-Channel/8-Channel 10-Bit A/D Converters with SPI Serial Interface, 16-Pin SOIC 150mil, Industrial Temperature; ComponentLink1URL: http://www.microchip.com/; ComponentLink3Description: Package Specification; PackageDescription: 16-Lead Plastic Small Outline (SL) - Narrow, 3.90mm Body [SOIC]; PackageVersion: revBB, Aug-2009; ComponentLink2Description: Datasheet; Code_IPC: SOIC127P600-16; RevisionNote: URLs added.; ComponentLink3URL: http://www.microchip.com/stellent/groups/techpub_sg/documents/packagingspec/en012702.pdf; ComponentLink1Description: Manufacturer URL; ComponentLink2URL: http://ww1.microchip.com/downloads/en/DeviceDoc/21295d.pdf; Code_JEDEC: MS-012-AC; DatasheetVersion: revD, Dec-2008; PackageReference: SOIC-SL16
VR1 VR2 = CMP-00001-1: ±10% ±100ppm/℃ 500mW 10kΩ Plugin-3P,7x6.6mm Potentiometers, Variable Resistors ROHS; Package Width: 6.99mm; Lead Diameter: 0.46mm; Package Height: 4.7mm; Resistance Law: Linear; Number of Turns: 1; Lead Length: 5.46mm; Actuator Type: SCREW; Temperature Coefficient (ppm/Cel): -100,100; Package Length: 6.6mm; Actuator Orientation: Vertical; Rated Temperature: 70°C; Rotational Angle: 240°; JESD-609 Code: e3; Tolerance: 10%; Case/Package: 2628; Terminal Finish: Tin; Construction: Trimmer Pot; Termination: Wire; RoHS Compliant: Yes; Power: 500mW; Technology: CERMET; Pins: 3; Resistor Type: TRIMMER; Packaging: Rail/Tube; Mounting Technology: Through Hole; Part Number: 3362P-1-103LF; Reach SVHC Compliant: Yes; Package Shape: Rectangular; Max Operating Temperature: 125°C; Min Operating Temperature: -55°C; JLCPCB Part #: C58159